# Altium project EyeGait_Project.PrjPcb
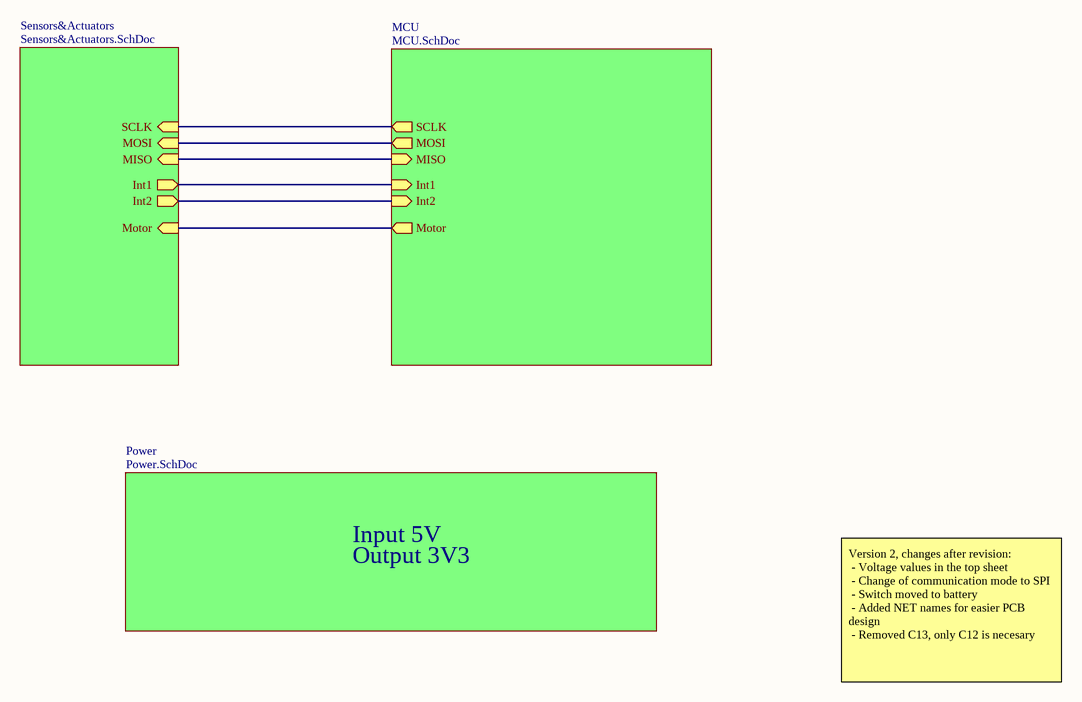
[diagram p0: Top.SchDoc]
DrawnBy: Alvaro Montesano & Javier Arroyos; E-mail: a.montesano@alumnos.upm.es & javier.arroyos@alumnos.upm.es; Engineer: Alvaro Montesano & Javier Arroyos; Project: EyeGait; TotalSheet: 4; VersionRevision: 1
4 sheets, 45 parts. Net scope: hierarchical (ports join the sheet entries above them; power ports are global).
Board file: EyeGait.PcbDoc
Sheets:
  Top.SchDoc
    Sensors&Actuators = Sensors&Actuators.SchDoc
    MCU = MCU.SchDoc
    Power = Power.SchDoc

## Sheet Top.SchDoc
size A4; SheetNumber: 1; SheetTotal: 4

### Sub-sheets
MCU = MCU.SchDoc: SCLK (out), MOSI (out), MISO (in), Motor (out), Int2 (in), Int1 (in)
Power = Power.SchDoc: no entries
Sensors&Actuators = Sensors&Actuators.SchDoc: Int1 (out), Int2 (out), MISO (in), Motor (in), SCLK (in), MOSI (in)

### Nets
Int1: sheet Sensors&Actuators/Int1, sheet MCU/Int1
Int2: sheet Sensors&Actuators/Int2, sheet MCU/Int2
MISO: sheet Sensors&Actuators/MISO, sheet MCU/MISO
MOSI: sheet Sensors&Actuators/MOSI, sheet MCU/MOSI
MOT: sheet Sensors&Actuators/Motor, sheet MCU/Motor
SCLK: sheet Sensors&Actuators/SCLK, sheet MCU/SCLK

### Notes on the sheet
- Input 5V
- Output 3V3
- Version 2, changes after revision:
  - Voltage values in the top sheet
  - Change of communication mode to SPI
  - Switch moved to battery
  - Added NET names for easier PCB design
  - Removed C13, only C12 is necesary
- Title:
- Drawn By:
- Page Contents:
- Size:
- Date:
- File:
- Engineers:
- Email:
- A4
- Number:
- Revision:
- Sheet
- of

## Sheet Sensors&Actuators.SchDoc
size A4; SheetNumber: 3; SheetTotal: 4
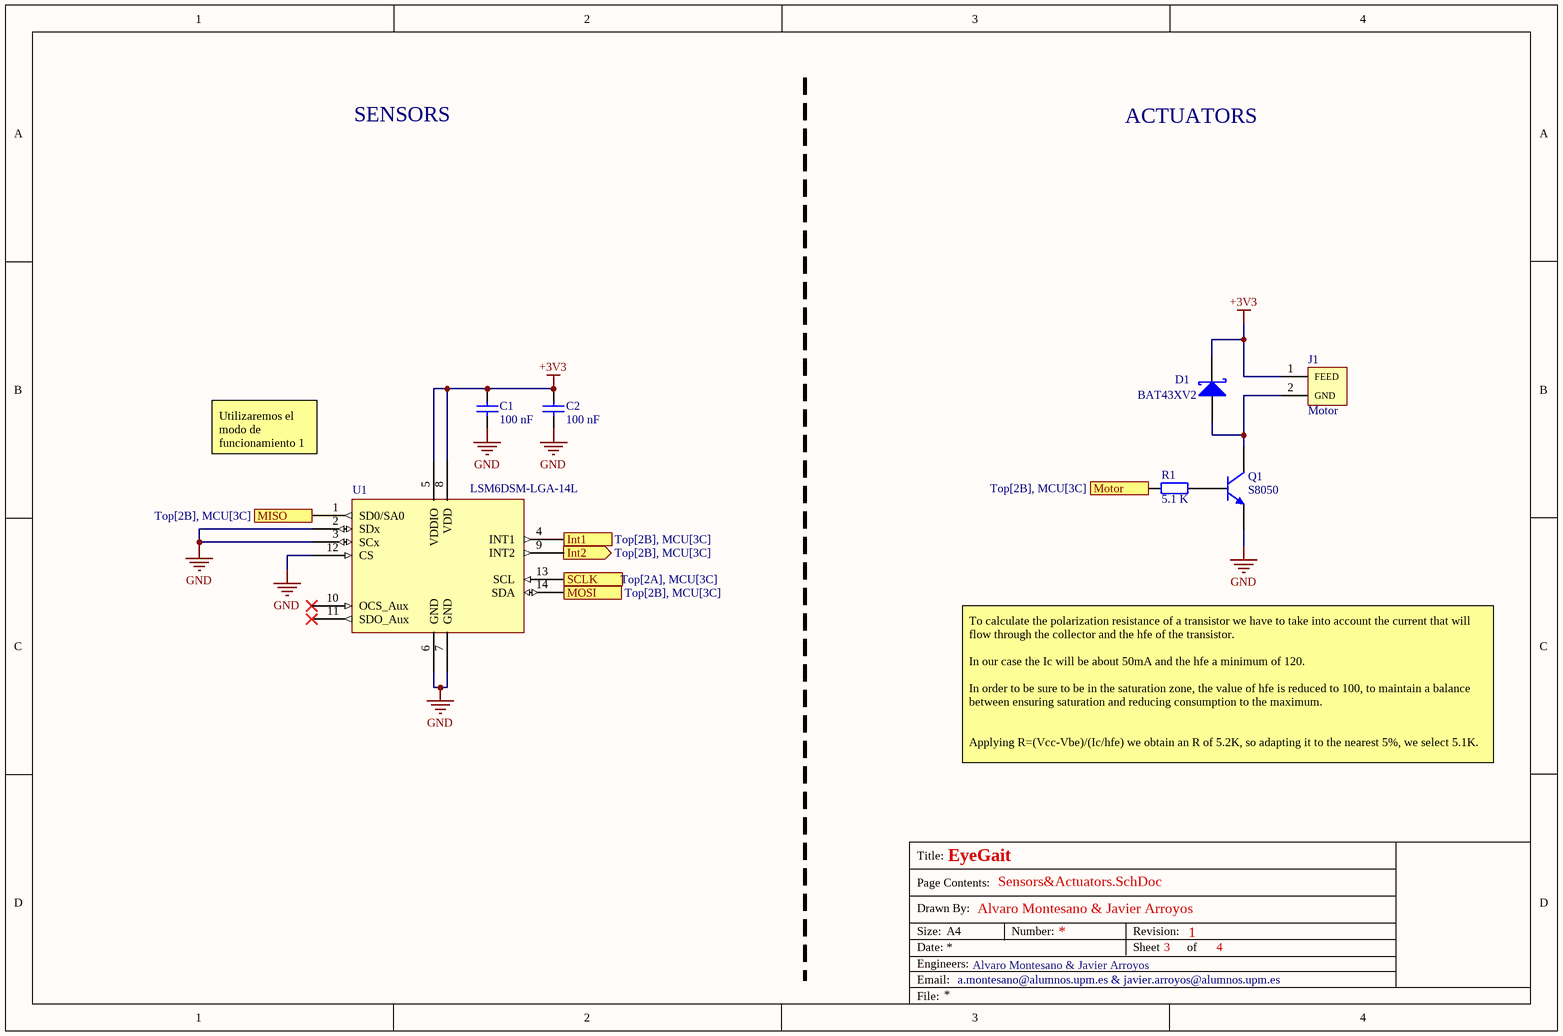
[diagram p1: Sensors&Actuators.SchDoc]

### Parts
C1  100 nF  [C0402]
C2  100 nF  [C0402]
D1  BAT43XV2  [SOD_523]
J1  Motor  [Hand solder wire polarity]
Q1  S8050  [SOT23]
R1  5.1 K  [R0402]
U1  LSM6DSM-LGA-14L  [LSM6DSM-LGA-14L-v2]

### Ports
Int1 (out, see Top[2B], MCU[3C]), Int2 (out, see Top[2B], MCU[3C]), MISO (out, see Top[2B], MCU[3C]), MOSI (in, see Top[2B], MCU[3C]), Motor (in, see Top[2B], MCU[3C]), SCLK (in, see Top[2A], MCU[3C])

### Nets
+3V3: C1.1 C2.1 D1.2(K) J1.1(FEED) U1.5(VDDIO) U1.8(VDD)
GND: C1.2 C2.2 Q1.2(E) U1.2(SDx) U1.3(SCx) U1.6(GND) U1.7(GND) U1.12(CS)
Int1: U1.4(INT1) ; port Int1
Int2: U1.9(INT2) ; port Int2
MISO: U1.1(SD0/SA0) ; port MISO
MOSI: U1.14(SDA) ; port MOSI
MOT: R1.1 ; port Motor
SCLK: U1.13(SCL) ; port SCLK
NetD1_1: D1.1(A) J1.2(GND) Q1.3(C)
NetQ1_1: Q1.1(B) R1.2

Not connected (* = marked no-connect by the designer): U1 10(OCS_Aux)* 11(SDO_Aux)*

### Notes on the sheet
- SENSORS
- ACTUATORS
- Utilizaremos el modo de funcionamiento 1
- To calculate the polarization resistance of a transistor we have to take into account the current that will flow through the collector and the hfe of the transistor.
  In our case the Ic will be about 50mA and the hfe a minimum of 120.
  In order to be sure to be in the saturation zone, the value of hfe is reduced to 100, to maintain a balance between ensuring saturation and reducing consumption to the maximum.
  Applying R=(Vcc-Vbe)/(Ic/hfe) we obtain an R of 5.2K, so adapting it to the nearest 5%, we select 5.1K.
- Title:
- Drawn By:
- Page Contents:
- Size:
- Date:
- File:
- Engineers:
- Email:
- A4
- Number:
- Revision:
- Sheet
- of

### Library data of the parts
C1 C2 = C: Capacitor
D1 = D Schottky: Schottky Diode
Q1 = NPN: NPN Bipolar Transistor
R1 = R: Resistor
U1 = LSM6DSM-LGA-14L: 6-axis IMU, Accel&Gyro

## Sheet MCU.SchDoc
size A4; SheetNumber: 2; SheetTotal: 4
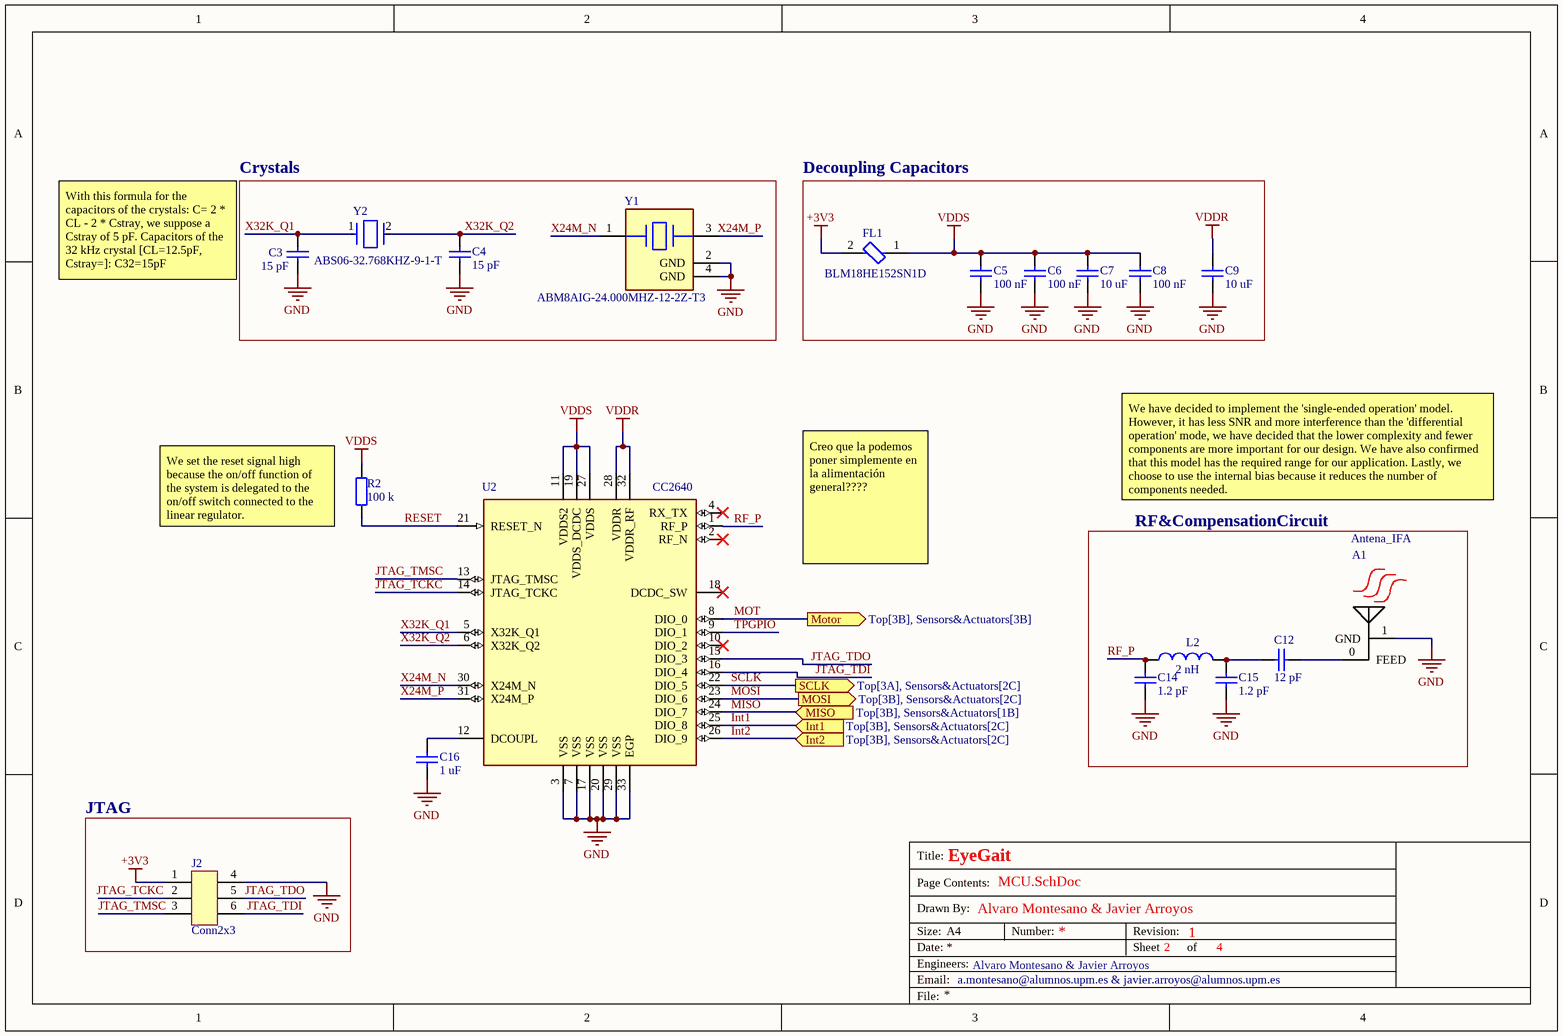
[diagram p2: MCU.SchDoc]

### Parts
A1  Antena_IFA  [ANTENA_IFA]
C3  15 pF  [C0402]
C4  15 pF  [C0402]
C5  100 nF  [C0402]
C6  100 nF  [C0402]
C7  10 uF  [C0402]
C8  100 nF  [C0402]
C9  10 uF  [C0402]
C12  12 pF  [C0402]
C14  1.2 pF  [C0402]
C15  1.2 pF  [C0402]
C16  1 uF  [C0402]
FL1  BLM18HE152SN1D  [FP-BLM18-0_15-t0_8-IPC_C]
J2  Conn2x3  [Pogo_6pins_minimum]
L2  2 nH  [L0402]
R2  100 k  [R0402]
U2  CC2640  [CC2640R2FRSM]
Y1  ABM8AIG-24.000MHZ-12-2Z-T3  [FP-ABM8AIG-MFG]
Y2  ABS06-32.768KHZ-9-1-T  [FP-ABS06-MFG]

### Blocks framed on the sheet
Crystals: C3 C4 Y1 Y2
Decoupling Capacitors: C5-C9 FL1
RF&CompensationCircuit: A1 C12 C14 C15 L2
JTAG: J2

### Ports
Int1 (in, see Top[3B], Sensors&Actuators[2C]), Int2 (in, see Top[3B], Sensors&Actuators[2C]), MISO (in, see Top[3B], Sensors&Actuators[1B]), MOSI (out, see Top[3B], Sensors&Actuators[2C]), Motor (out, see Top[3B], Sensors&Actuators[3B]), SCLK (out, see Top[3A], Sensors&Actuators[2C])

### Nets
+3V3: FL1.2 J2.1
GND: A1.1(GND) C3.1 C4.1 C5.2 C6.2 C7.2 C8.2 C9.2 C14.1 C15.1 C16.1 J2.4 U2.3(VSS) U2.7(VSS) U2.17(VSS) U2.20(VSS) U2.29(VSS) U2.33(EGP) Y1.2(GND) Y1.4(GND)
VDDR: C9.1 U2.28(VDDR) U2.32(VDDR_RF)
VDDS: C5.1 C6.1 C7.1 C8.1 FL1.1 R2.1 U2.11(VDDS2) U2.19(VDDS_DCDC) U2.27(VDDS)
Int1: U2.25(DIO_8) ; port Int1
Int2: U2.26(DIO_9) ; port Int2
JTAG_TCKC: J2.2 U2.14(JTAG_TCKC)
JTAG_TDI: J2.6 U2.16(DIO_4)
JTAG_TDO: J2.5 U2.15(DIO_3)
JTAG_TMSC: J2.3 U2.13(JTAG_TMSC)
MISO: U2.24(DIO_7) ; port MISO
MOSI: U2.23(DIO_6) ; port MOSI
MOT: U2.8(DIO_0) ; port Motor
RESET: R2.2 U2.21(RESET_N)
RF_P: C14.2 L2.1 U2.1(RF_P)
SCLK: U2.22(DIO_5) ; port SCLK
TPGPIO: U2.9(DIO_1)
X24M_N: U2.30(X24M_N) Y1.1
X24M_P: U2.31(X24M_P) Y1.3
X32K_Q1: C3.2 U2.5(X32K_Q1) Y2.1
X32K_Q2: C4.2 U2.6(X32K_Q2) Y2.2
NetA1_0: A1.0(FEED) C12.2
NetC12_1: C12.1 C15.2 L2.2
NetC16_2: C16.2 U2.12(DCOUPL)

Not connected (* = marked no-connect by the designer): U2 2(RF_N)* 4(RX_TX)* 10(DIO_2)* 18(DCDC_SW)*

### Notes on the sheet
- With this formula for the capacitors of the crystals: C= 2 * CL - 2 * Cstray, we suppose a Cstray of 5 pF. Capacitors of the 32 kHz crystal [CL=12.5pF, Cstray=]: C32=15pF
- We have decided to implement the 'single-ended operation' model. However, it has less SNR and more interference than the 'differential operation' mode, we have decided that the lower complexity and fewer components are more important for our design. We have also confirmed that this model has the required range for our application. Lastly, we choose to use the internal bias because it reduces the number of components needed.
- (near R2) We set the reset signal high because the on/off function of the system is delegated to the on/off switch connected to the linear regulator.
- Creo que la podemos poner simplemente en la alimentación general????
- Title:
- Drawn By:
- Page Contents:
- Size:
- Date:
- File:
- Engineers:
- Email:
- A4
- Number:
- Revision:
- Sheet
- of

### Library data of the parts
C3-C9 C12 C14-C16 = C: Capacitor
FL1 = CMP-0686-00368-3: Chip Ferrite Bead, 0603, 1500Ω @ 100MHz, 0.5Ω, 25%, 500mA; Impedance: 1.5kR; DC Resistance (DCR): 500mR; Number of Circuits: 1; Test Frequency: 100MHz; Case/Package: 0603; Max Operating Temperature: 125°C; Package Quantity: 1; Max DC Current: 500mA; Tolerance: 25%; Core Material: Ferrite; Width: 0.8mm; Number of Pins: 2; Depth: 0.8mm; Radiation Hardening: No; Case Code (Imperial): 0603; Min Operating Temperature: -55°C; Termination: SMD/SMT; Material: Ferrite; Military Standard: Not; Number of Lines: 1; DC Current: 500mA; Length: 1.6mm; REACH SVHC: No SVHC; Lead Free: Lead Free; Current Rating: 500mA; Max Current Rating: 500mA; Packaging: Tape and Reel; Case Code (Metric): 1608; Height: 0.8mm
J2 = Conn2x3: 2x3 pin Terminal
L2 = L: Inductor
R2 = R: Resistor
U2 = CC2640: IC RF TXRX+MCU BLUETOOTH 32VFQFN; Manufacturer: Texas Instruments; Part number: CC2640R2FRSM; Supplier 1: Mouser; Supplier Part Number 1: 595-CC2640R2FRSMR
Y1 = CMP-27762-015716-1: Crystal 24MHz ±20ppm (Tol) ±50ppm (Stability) 12pF FUND 50Ω Automotive 4-Pin Ultra Mini-CSMD T/R; ESR (Equivalent Series Resistance): 50R; Series: ABM8AIG; RoHS Compliant: Yes; Load Capacitance: 12pF; Height: 0.031inch; Min Operating Temperature: -40°C; Mount: Surface Mount; Packaging: Cut Tape; Ratings: AEC-Q200; Case/Package: SMD/SMT; Frequency Stability: 50ppm; Max Operating Temperature: 125°C; Length: 0.126inch; Frequency: 24MHz; Frequency Tolerance: 20ppm; Width: 0.098inch
Y2 = CMP-27762-003430-2: Crystal 32.768kHz ±10ppm (Tol) 9pF FUND 90kΩ 2-Pin Mini-CSMD T/R; Series Resistance: 90kR; Series: ABS06; Case/Package: CSMD; Package Quantity: 3000; Load Capacitance: 9pF; Number of Pins: 2; Tolerance: 10ppm; RoHS Compliant: Yes; Depth: 1.2mm; Termination: SMD/SMT; Min Operating Temperature: -40°C; Length: 2mm; Packaging: Tape and Reel; Max Operating Temperature: 85°C; Frequency Tolerance: 10ppm; Width: 1.2mm; ESR (Equivalent Series Resistance): 90kR; Radiation Hardening: No; Frequency: 32.768kHz; REACH SVHC: No SVHC; Mount: Surface Mount; Height: 0.6mm

## Sheet Power.SchDoc
size A4; SheetNumber: 4; SheetTotal: 4
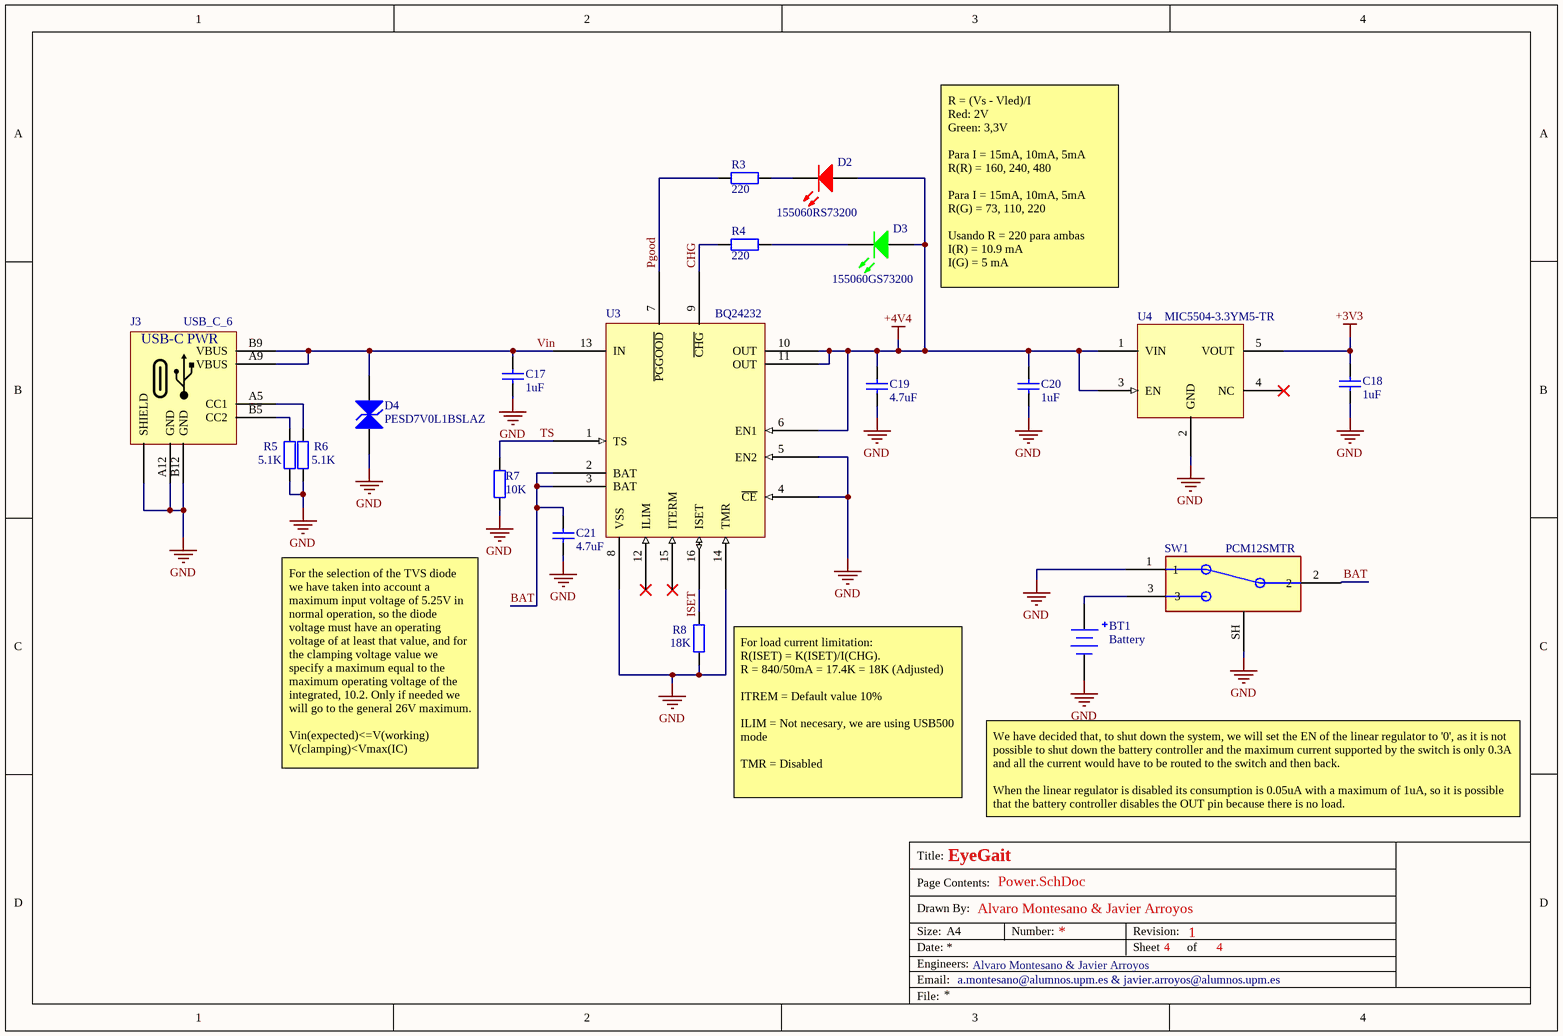
[diagram p3: Power.SchDoc]

### Parts
BT1  Battery  [Hand solder wire polarity]
C17  1uF  [C0402]
C18  1uF  [C0402]
C19  4.7uF  [C0402]
C20  1uF  [C0402]
C21  4.7uF  [C0402]
D2  155060RS73200  [LED_Side_0603]
D3  155060GS73200  [LED_Side_0603]
D4  PESD7V0L1BSLAZ  [DFN1006-2/SOD882]
J3  USB_C_6  [USB4135-GF-A]
R3  220  [R0402]
R4  220  [R0402]
R5  5.1K  [R0402]
R6  5.1K  [R0402]
R7  10K  [R0402]
R8  18K  [R0402]
SW1  PCM12SMTR  [PCM12SMTR]
U3  BQ24232  [QFN50P300X300X100_HS-17N]
U4  MIC5504-3.3YM5-TR  [SOT23-5]

### Nets
+3V3: C18.1 U4.5(VOUT)
+4V4: C19.1 C20.1 D2.1(A) D3.1(A) U3.6(EN1) U3.10(OUT) U3.11(OUT) U4.1(VIN) U4.3(EN)
GND: BT1.2(-) C17.2 C18.2 C19.2 C20.2 C21.2 D4.1(A) J3.A12(GND) J3.B12(GND) J3.SHIELD R5.1 R6.1 R7.2 R8.1 SW1.1 SW1.SH U3.4(~{CE}) U3.5(EN2) U3.8(VSS) U3.14(TMR) U4.2(GND)
BAT: C21.1 SW1.2 U3.2(BAT) U3.3(BAT)
CHG: R4.2 U3.9(~{CHG})
ISET: R8.2 U3.16(ISET)
Pgood: R3.2 U3.7(~{PGGOOD})
TS: R7.1 U3.1(TS)
Vin: C17.1 D4.2(K) J3.A9(VBUS) J3.B9(VBUS) U3.13(IN)
NetBT1_1: BT1.1(+) SW1.3
NetD2_2: D2.2(K) R3.1
NetD3_2: D3.2(K) R4.1
NetJ3_A5: J3.A5(CC1) R6.2
NetJ3_B5: J3.B5(CC2) R5.2

Not connected (* = marked no-connect by the designer): U3 12(ILIM)* 15(ITERM)*; U4 4(NC)*

### Notes on the sheet
- R = (Vs - Vled)/I
  Red: 2V
  Green: 3,3V
  Para I = 15mA, 10mA, 5mA
  R(R) = 160, 240, 480
  Para I = 15mA, 10mA, 5mA
  R(G) = 73, 110, 220
  Usando R = 220 para ambas
  I(R) = 10.9 mA
  I(G) = 5 mA
- For the selection of the TVS diode we have taken into account a maximum input voltage of 5.25V in normal operation, so the diode voltage must have an operating voltage of at least that value, and for the clamping voltage value we specify a maximum equal to the maximum operating voltage of the integrated, 10.2. Only if needed we will go to the general 26V maximum.
  Vin(expected)<=V(working)
  V(clamping)<Vmax(IC)
- (near R8) For load current limitation:
  R(ISET) = K(ISET)/I(CHG).
  R = 840/50mA = 17.4K = 18K (Adjusted)
  ITREM = Default value 10%
  ILIM = Not necesary, we are using USB500 mode
  TMR = Disabled
- We have decided that, to shut down the system, we will set the EN of the linear regulator to '0', as it is not possible to shut down the battery controller and the maximum current supported by the switch is only 0.3A and all the current would have to be routed to the switch and then back.
  When the linear regulator is disabled its consumption is 0.05uA with a maximum of 1uA, so it is possible that the battery controller disables the OUT pin because there is no load.
- Title:
- Drawn By:
- Page Contents:
- Size:
- Date:
- File:
- Engineers:
- Email:
- A4
- Number:
- Revision:
- Sheet
- of
- (in symbol USB_C_6) USB-C PWR

### Library data of the parts
BT1 = Battery: Multicell Battery
C17 C18 C20 C21 = C: Capacitor
C19 = C: Capacitor; Voltage: >10V
D2 = LED_R: Red LED
D3 = LED_G: Green LED
D4 = D Zener_Bidirectional: Zener Diode Bidirectional
J3 = USB_C_6: USB-C 6 pin connector for power only. 20V/3A
R3-R8 = R: Resistor
U3 = BQ24232: Power management IC. USB-Friendly Lithium-Ion Battery Charger And Power-Path Management IC

## Nets that join several sheets
+3V3: Sensors&Actuators (6 pins), MCU (FL1.2 J2.1), Power (C18.1 U4.5)
GND: Sensors&Actuators (8 pins), MCU (20 pins), Power (21 pins)
Int1: Sensors&Actuators (U1.4), MCU (U2.25)
Int2: Sensors&Actuators (U1.9), MCU (U2.26)
MISO: Sensors&Actuators (U1.1), MCU (U2.24)
MOSI: Sensors&Actuators (U1.14), MCU (U2.23)
MOT: Sensors&Actuators (R1.1), MCU (U2.8)
SCLK: Sensors&Actuators (U1.13), MCU (U2.22)